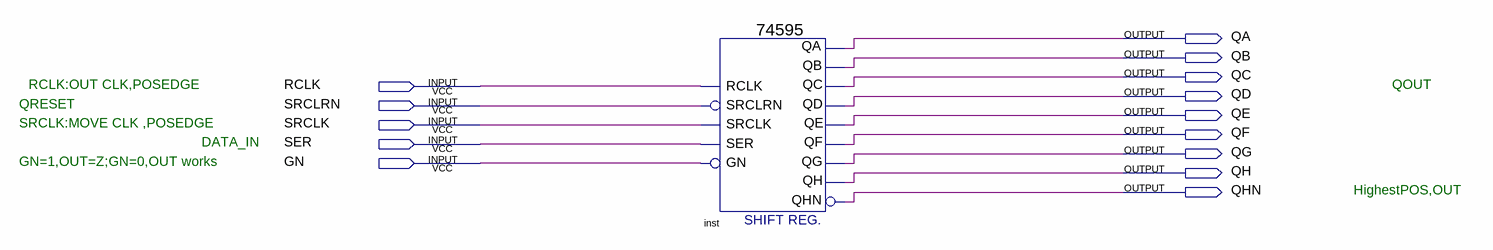
[diagram p0: schematic sheet]
// Quartus schematic lab302ShiftReg.bdf as structural Verilog: 1 symbols, 14 pins
module lab302ShiftReg (
  input  RCLK,
  input  SRCLRN,
  input  SRCLK,
  input  SER,
  input  GN,
  output QA,
  output QB,
  output QC,
  output QD,
  output QE,
  output QF,
  output QG,
  output QH,
  output QHN
);

  \74595  inst (
    .RCLK(RCLK), .SRCLRN(SRCLRN), .SRCLK(SRCLK), .SER(SER), .GN(GN), .QHN(QHN), .QH(QH), .QG(QG), .QF(QF),
    .QE(QE), .QC(QC), .QD(QD), .QA(QA), .QB(QB));

  // Notes on the sheet:
  //   RCLK:OUT CLK,POSEDGE
  //   QOUT
  //   QRESET
  //   SRCLK:MOVE CLK ,POSEDGE
  //   DATA_IN
  //   GN=1,OUT=Z;GN=0,OUT works
  //   HighestPOS,OUT
endmodule
